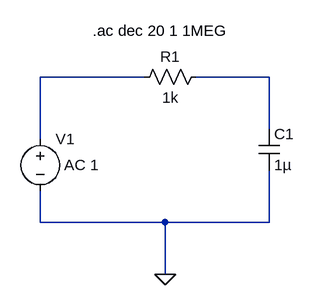
[diagram p0: schematic domacizad.asc]
domacizad.asc, the LTspice schematic file:
Version 4
SHEET 1 880 680
WIRE 176 16 16 16
WIRE 368 16 256 16
WIRE 368 96 368 16
WIRE 16 112 16 16
WIRE 16 240 16 192
WIRE 208 240 16 240
WIRE 368 240 368 160
WIRE 368 240 208 240
WIRE 208 320 208 240
FLAG 208 320 0
SYMBOL res 272 0 R90
WINDOW 0 0 56 VBottom 2
WINDOW 3 32 56 VTop 2
SYMATTR InstName R1
SYMATTR Value 1k
SYMBOL cap 352 96 R0
SYMATTR InstName C1
SYMATTR Value 1µ
SYMBOL voltage 16 96 R0
WINDOW 123 37 56 Left 2
WINDOW 39 0 0 Left 2
SYMATTR InstName V1
SYMATTR Value ""
SYMATTR Value2 AC 1
TEXT 97 -55 Left 2 !.ac dec 20 1 1MEG

The netlist it stands for:
* domacizad.asc
R1 N002 N001 1k
C1 N002 0 1µ
V1 N001 0 AC 1
.ac dec 20 1 1MEG
.backanno
.end